# Altium schematic sheet power-v0v75.SchDoc
size Letter; CheckedBy: E. Chiu; CompanyName: Signal Laboratories, Inc.; DrawnBy: J. Brinton; Engineer: J. Brinton; Address1: 3479 Edison Way; Address2: Menlo Park CA 94025; Address3: +1 (877) 778-8435; Address4: siglabs.com; Revision: 1; SheetNumber: 8; SheetTotal: 39
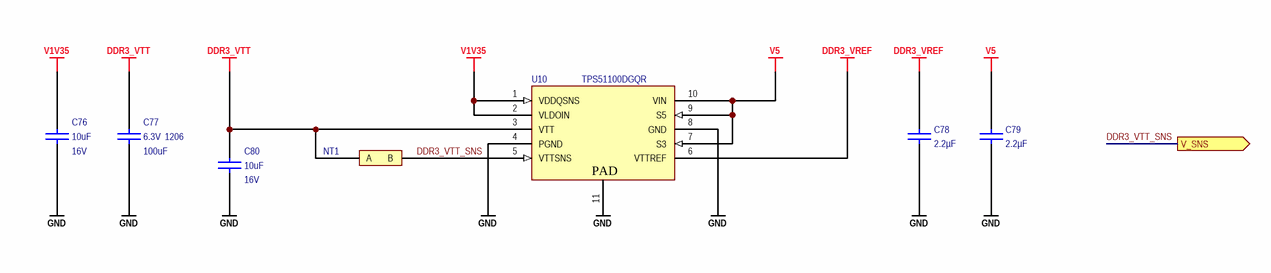
[diagram p0: power-v0v75.SchDoc]

## Parts
C76  value 10uF  Voltage: 16V  [CAPC1608X90N]  (hidden comment: CAP 10UF 0603)
C77  value 100uF  Voltage: 6.3V  PCB Package: 1206  [CAPC3216X180L55N]  (hidden comment: GRM31CR60J107ME39K)
C78  value 2.2µF  [CAPC1608X90N]  (hidden comment: GRM188R71A225KE15D)
C79  value 2.2µF  [CAPC1608X90N]  (hidden comment: GRM188R71A225KE15D)
C80  value 10uF  Voltage: 16V  [CAPC1608X90N]  (hidden comment: EMK107BBJ106MA-T)
NT1  NET_TIE  [NET_TIE]  (value not drawn)  (net tie, no BOM)
U10  TPS51100DGQR  [SOP11P50_300X490X110L55X22T157X188N]

## Ports
V_SNS (out)

## Nets
DDR3_VREF: C78.2 U10.6(VTTREF)
DDR3_VTT: C77.1 C80.2 NT1.A U10.3(VTT)
GND: C76.1 C77.2 C78.1 C79.1 C80.1 U10.4(PGND) U10.8(GND) U10.11(PAD)
V1V35: C76.2 U10.1(VDDQSNS) U10.2(VLDOIN)
V5: C79.2 U10.7(S3) U10.9(S5) U10.10(VIN)
DDR3_VTT_SNS: NT1.B U10.5(VTTSNS) ; port V_SNS

## Notes on the sheet
- Title
- Engineer
- Revision
- Drawn By
- Checked By
- Date
- Sheet
- of

## Library data of the parts
C76 = CAP: Ceramic Capacitor 10uF +/-20% 16V X5R 0603; Manufacturer: Taiyo Yuden; Manufacturer P/N: EMK107BBJ106MA-T; Tolerance: *; Tr: *
C77 = CAP: Ceramic Capacitor 100uF +/-20% 6.3V X5R 1206; Manufacturer: Murata Electronics; Manufacturer P/N: GRM31CR60J107ME39K; Tolerance: *; Tr: *
C78 C79 = GRM188R71A225KE15D: CAP CER 2.2UF 10V 10% X7R 0603; Manufacturer: Murata Electronics; Manufacturer P/N: GRM188R71A225KE15D; Tolerance: ±10%; Package / Case: 0603 (1608 Metric); Temperature Coefficient: X7R; Voltage - Rated: 10V
C80 = CAP: Ceramic Capacitor 10uF +/-20% 16V X5R 0603; Manufacturer: Taiyo Yuden; Manufacturer P/N: EMK107BBJ106MA-T; Tolerance: *; Tr: *
U10 = TPS51100DGQR: IC Voltage Reg DDR1/2/3 VTT; Manufacturer: Texas Instruments; Value: TPS51100DGQR; Manufacturer P/N: TPS51100DGQR